# Altium schematic sheet EEPROM_AT24.SchDoc
size A; SheetNumber: 6; SheetTotal: 7
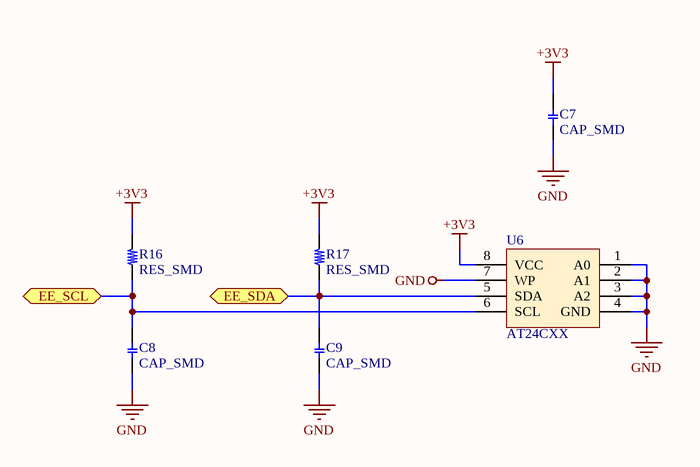
[diagram p0: EEPROM_AT24.SchDoc]

## Parts
C7  CAP_SMD  [C 0603]
C8  CAP_SMD  [C 0603]
C9  CAP_SMD  [C 0603]
R16  RES_SMD  [R 0603]
R17  RES_SMD  [R 0603]
U6  AT24CXX  [SOIC-8]

## Ports
EE_SCL (bidir), EE_SDA (bidir)

## Nets
+3V3: C7.2 R16.2 R17.2 U6.8(VCC)
GND: C7.1 C8.1 C9.1 U6.1(A0) U6.2(A1) U6.3(A2) U6.4(GND) U6.7(WP)
EE_SCL: C8.2 R16.1 U6.6(SCL) ; port EE_SCL
EE_SDA: C9.2 R17.1 U6.5(SDA) ; port EE_SDA